# EAGLE board schematic_March8 (EAGLE 9.3.0), part 1 of 2
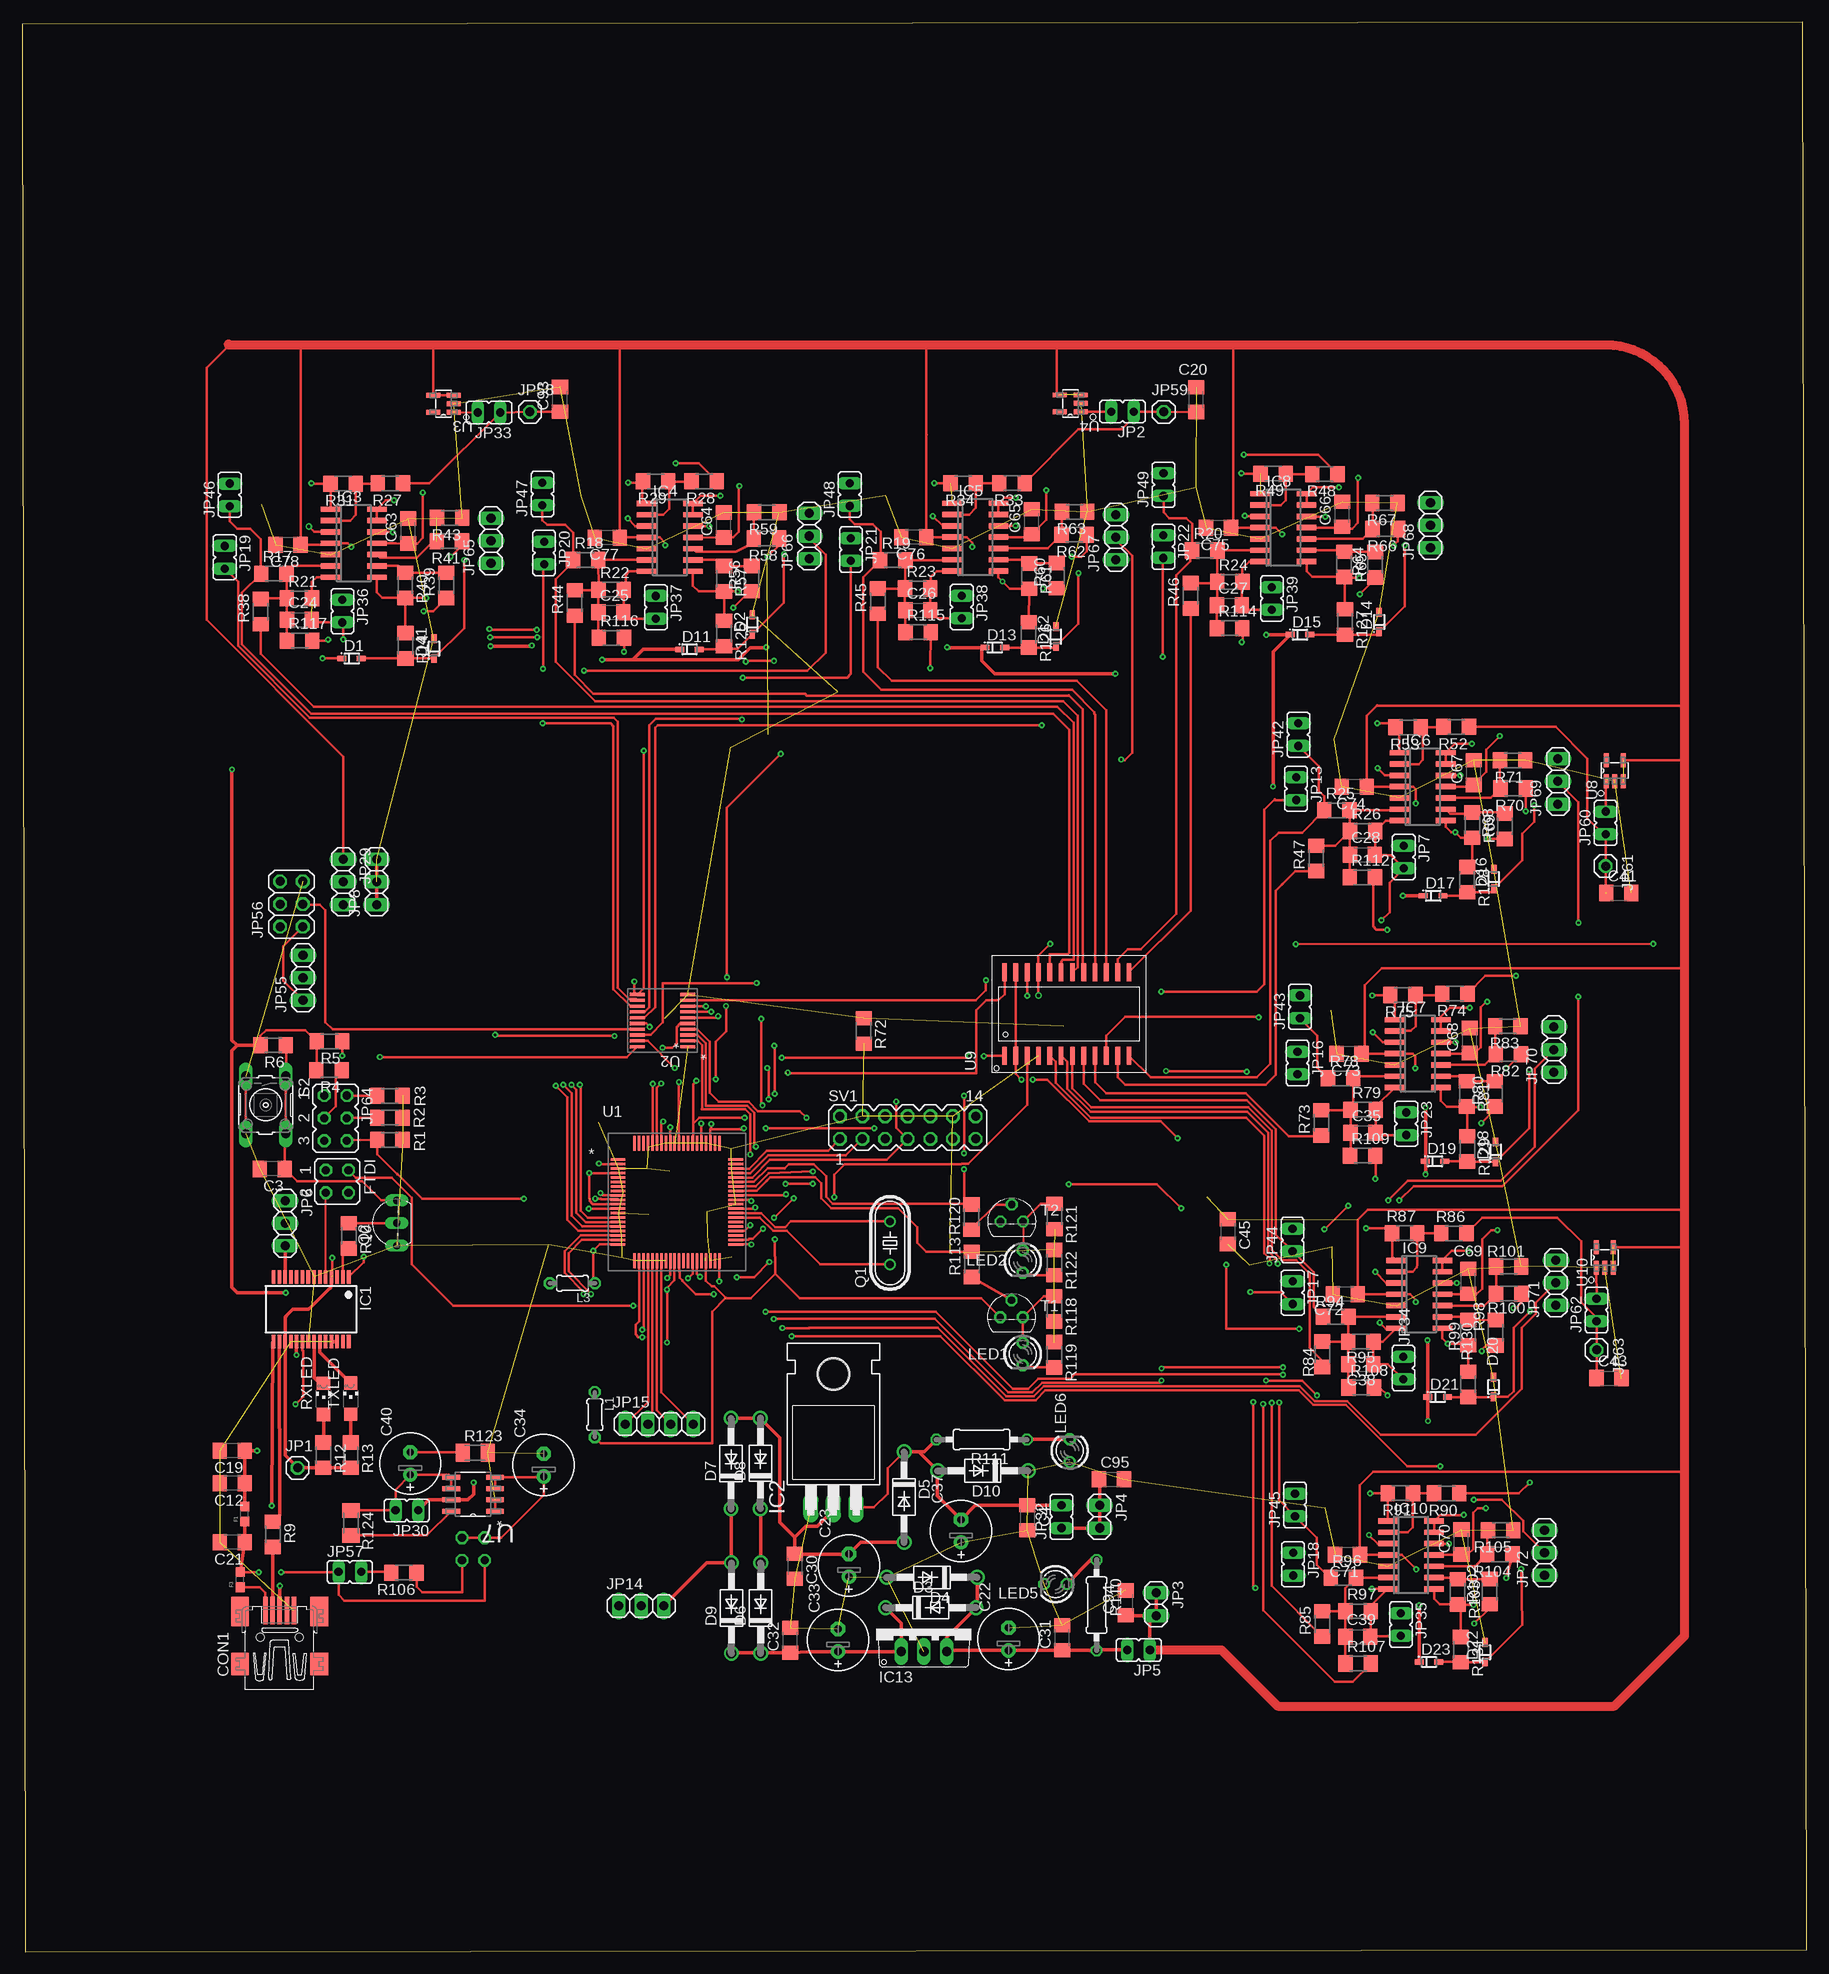
[diagram p2: board, top side]
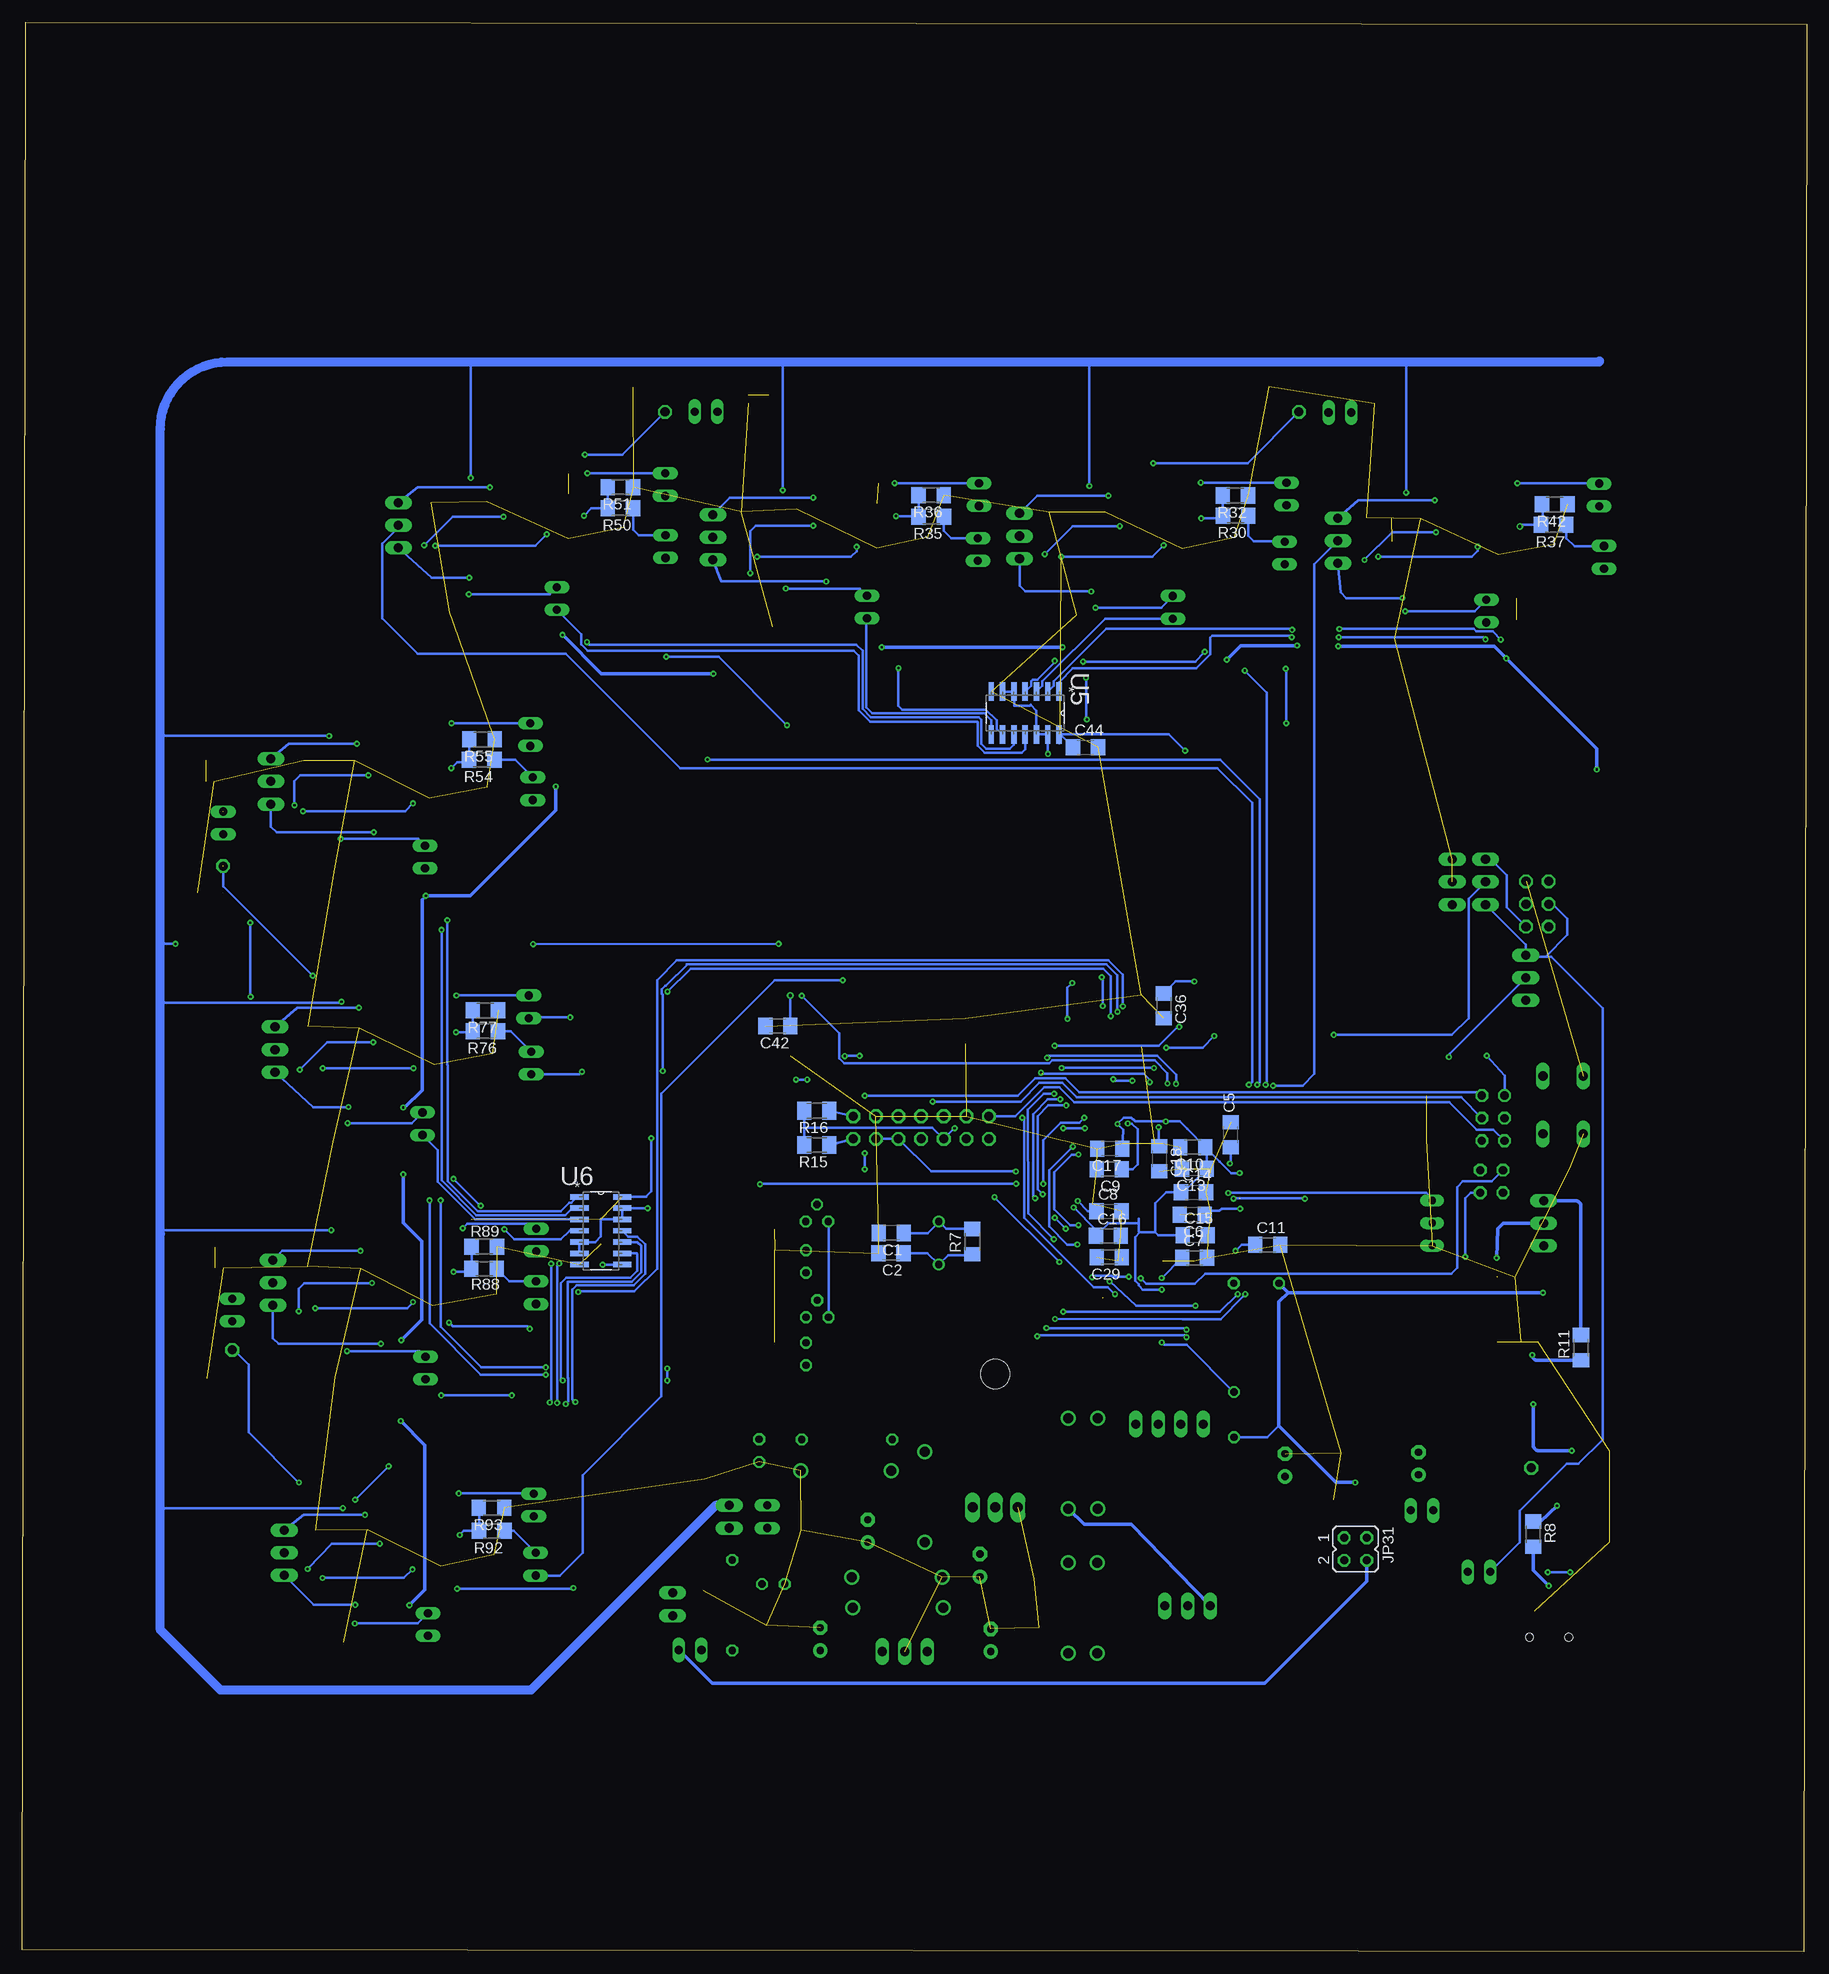
[diagram p3: board, bottom side, seen from below]

Size 200.34 x 216.64 mm. Coordinates in mm from the lower left corner, seen from the top.
Outline: 0.33,0 200.34,0.23 199.93,216.64 0,216.41 0.33,0
Copper layers (1*16): Top 0.035mm / dielectric 1.5mm / Bottom 0.035mm
Design rules "default *": minimum track width 8mil, minimum drill 10mil, track to track 7mil, track to pad 7mil, pad to pad 7mil, via to via 7mil, smd to smd 7mil, copper to edge 10mil, drill to drill 7mil, minimum pad ring 10mil, minimum via ring 8mil, stop-mask expansion 4mil, vias tented up to drill 0mil, thermal gap 10mil
Net classes: 1 power: width 0.254 mm

## Footprints (pad centres in the part's own frame; a part is rotated, then mirrored left to right if it is on the bottom)
C1206 = smd 1.6 x 1.8: 1 -1.4,0; 2 1.4,0
E2,5-7 = drill 0.813 pad 1.6: + -1.27,0 | drill 0.813 pad 1.6 octagon: - 1.27,0
32005-201 = smd 3.1 x 0.5: 1 3,1.6; 2 3,0.8; 3 3,0; 4 3,-0.8; 5 3,-1.6 | smd 2.5 x 2: M1 -3,-4.45; M2 -3,4.45 | smd 3.3 x 2: M3 2.9,4.45; M4 2.9,-4.45 | hole 0.9: 0,2.2; 0,-2.2
SOD323F = smd 1 x 0.6: A 1.1,0; C -1.1,0
DO41-10 = drill 1.118: A 5.08,0; C -5.08,0
0603 = smd 1.1 x 1: 1 -0.85,0; 2 0.85,0
JP2Q = drill 0.914 octagon: 1 -1.27,-1.27; 2 1.27,-1.27; 3 -1.27,1.27; 4 1.27,1.27
SSOP28 = smd 0.4 x 1.5: 1 -4.225,-3.625; 2 -3.575,-3.625; 3 -2.925,-3.625; 4 -2.275,-3.625; 5 -1.625,-3.625; 6 -0.975,-3.625; 7 -0.325,-3.625; 8 0.325,-3.625; 9 0.975,-3.625; 10 1.625,-3.625; 11 2.275,-3.625; 12 2.925,-3.625; 13 3.575,-3.625; 14 4.225,-3.625; 15 4.225,3.625; 16 3.575,3.625; 17 2.925,3.625; 18 2.275,3.625; 19 1.625,3.625; 20 0.975,3.625; 21 0.325,3.625; 22 -0.325,3.625; 23 -0.975,3.625; 24 -1.625,3.625; 25 -2.275,3.625; 26 -2.925,3.625; 27 -3.575,3.625; 28 -4.225,3.625
TO220H = drill 1.118 long: 1 -2.54,-10.16; 2 0,-10.16; 3 2.54,-10.16 | hole 3.302: 0,4.826
SO14 = smd 0.6 x 2.2: 1 -3.81,-2.6; 2 -2.54,-2.6; 3 -1.27,-2.6; 4 0,-2.6; 5 1.27,-2.6; 6 2.54,-2.6; 7 3.81,-2.6; 8 3.81,2.6; 9 2.54,2.6; 10 1.27,2.6; 11 0,2.6; 12 -1.27,2.6; 13 -2.54,2.6; 14 -3.81,2.6
TO220V = drill 1.016 long: 1 -2.54,-2.54; 2 0,-2.54; 3 2.54,-2.54
1X01 = drill 1.016 octagon: 1 0,0
JP1 = drill 0.914 long: 1 0,-1.27; 2 0,1.27
1X02 = drill 1.016 long: 1 -1.27,0; 2 1.27,0
1X03 = drill 1.016 long: 1 -2.54,0; 2 0,0; 3 2.54,0
1X04 = drill 1.016 long: 1 -3.81,0; 2 -1.27,0; 3 1.27,0; 4 3.81,0
2X03 = drill 1.016 octagon: 1 -2.54,-1.27; 2 -2.54,1.27; 3 0,-1.27; 4 0,1.27; 5 2.54,-1.27; 6 2.54,1.27
JP3Q = drill 0.914 octagon: 1 -2.54,-1.27; 2 -2.54,1.27; 3 0,-1.27; 4 0,1.27; 5 2.54,-1.27; 6 2.54,1.27
0204/5 = drill 0.813 octagon: 1 -2.54,0; 2 2.54,0
LED3MM = drill 0.813 octagon: A -1.27,0; K 1.27,0
HC49/S = drill 0.813: 1 -2.413,0; 2 2.413,0
TO92-EBC = drill 0.813 long: B 0,-1.27; C -2.54,-1.27; E 2.54,-1.27
R1206 = smd 1.6 x 1.803: 1 -1.422,0; 2 1.422,0
M1206 = smd 1.6 x 2: 1 -1.4,0; 2 1.4,0
0207/10 = drill 0.813 octagon: 1 -5.08,0; 2 5.08,0
CHIPLED_1206 = smd 1.5 x 1.5: A 0,-1.75; C 0,1.75
B3F-10XX = drill 1.016 long: 1 -3.251,2.261; 2 3.251,2.261; 3 -3.251,-2.261; 4 3.251,-2.261
MA07-2 = drill 1.016 octagon: 1 -7.62,-1.27; 2 -7.62,1.27; 3 -5.08,-1.27; 4 -5.08,1.27; 5 -2.54,-1.27; 6 -2.54,1.27; 7 0,-1.27; 8 0,1.27; 9 2.54,-1.27; 10 2.54,1.27; 11 5.08,-1.27; 12 5.08,1.27; 13 7.62,-1.27; 14 7.62,1.27
TO92 = drill 0.813 octagon: 1 1.27,0; 2 0,1.905; 3 -1.27,0
PN80 = smd 1.676 x 0.279: 1 -6.617,4.75; 2 -6.617,4.25; 3 -6.617,3.75; 4 -6.617,3.25; 5 -6.617,2.75; 6 -6.617,2.25; 7 -6.617,1.75; 8 -6.617,1.25; 9 -6.617,0.75; 10 -6.617,0.25; 11 -6.617,-0.25; 12 -6.617,-0.75; 13 -6.617,-1.25; 14 -6.617,-1.75; 15 -6.617,-2.25; 16 -6.617,-2.75; 17 -6.617,-3.25; 18 -6.617,-3.75; 19 -6.617,-4.25; 20 -6.617,-4.75; 41 6.617,-4.75; 42 6.617,-4.25; 43 6.617,-3.75; 44 6.617,-3.25; 45 6.617,-2.75; 46 6.617,-2.25; 47 6.617,-1.75; 48 6.617,-1.25; 49 6.617,-0.75; 50 6.617,-0.25; 51 6.617,0.25; 52 6.617,0.75; 53 6.617,1.25; 54 6.617,1.75; 55 6.617,2.25; 56 6.617,2.75; 57 6.617,3.25; 58 6.617,3.75; 59 6.617,4.25; 60 6.617,4.75 | smd 0.279 x 1.676: 21 -4.75,-6.617; 22 -4.25,-6.617; 23 -3.75,-6.617; 24 -3.25,-6.617; 25 -2.75,-6.617; 26 -2.25,-6.617; 27 -1.75,-6.617; 28 -1.25,-6.617; 29 -0.75,-6.617; 30 -0.25,-6.617; 31 0.25,-6.617; 32 0.75,-6.617; 33 1.25,-6.617; 34 1.75,-6.617; 35 2.25,-6.617; 36 2.75,-6.617; 37 3.25,-6.617; 38 3.75,-6.617; 39 4.25,-6.617; 40 4.75,-6.617; 61 4.75,6.617; 62 4.25,6.617; 63 3.75,6.617; 64 3.25,6.617; 65 2.75,6.617; 66 2.25,6.617; 67 1.75,6.617; 68 1.25,6.617; 69 0.75,6.617; 70 0.25,6.617; 71 -0.25,6.617; 72 -0.75,6.617; 73 -1.25,6.617; 74 -1.75,6.617; 75 -2.25,6.617; 76 -2.75,6.617; 77 -3.25,6.617; 78 -3.75,6.617; 79 -4.25,6.617; 80 -4.75,6.617
PW20 = smd 1.676 x 0.356: 1 -2.819,2.925; 2 -2.819,2.275; 3 -2.819,1.625; 4 -2.819,0.975; 5 -2.819,0.325; 6 -2.819,-0.325; 7 -2.819,-0.975; 8 -2.819,-1.625; 9 -2.819,-2.275; 10 -2.819,-2.925; 11 2.819,-2.925; 12 2.819,-2.275; 13 2.819,-1.625; 14 2.819,-0.975; 15 2.819,-0.325; 16 2.819,0.325; 17 2.819,0.975; 18 2.819,1.625; 19 2.819,2.275; 20 2.819,2.925
DDC0005A_N = smd 1.575 x 0.559: 1 -1.168,0.95; 2 -1.168,0; 3 -1.168,-0.95; 4 1.168,-0.95; 5 1.168,0.95
SOIC127P600X175-14N = smd 2.057 x 0.61: 1 -4.801,7.62; 2 -4.801,6.35; 3 -4.801,5.08; 4 -4.801,3.81; 5 -4.801,2.54; 6 -4.801,1.27; 7 -4.801,0; 8 0,0; 9 0,1.27; 10 0,2.54; 11 0,3.81; 12 0,5.08; 13 0,6.35; 14 0,7.62
SOIC127P600X175-8N = smd 1.981 x 0.559: 1 -2.464,1.905; 2 -2.464,0.635; 3 -2.464,-0.635; 4 -2.464,-1.905; 5 2.464,-1.905; 6 2.464,-0.635; 7 2.464,0.635; 8 2.464,1.905
21-0042B_24 = smd 1.981 x 0.533: 1 -4.686,6.985; 2 -4.686,5.715; 3 -4.686,4.445; 4 -4.686,3.175; 5 -4.686,1.905; 6 -4.686,0.635; 7 -4.686,-0.635; 8 -4.686,-1.905; 9 -4.686,-3.175; 10 -4.686,-4.445; 11 -4.686,-5.715; 12 -4.686,-6.985; 13 4.686,-6.985; 14 4.686,-5.715; 15 4.686,-4.445; 16 4.686,-3.175; 17 4.686,-1.905; 18 4.686,-0.635; 19 4.686,0.635; 20 4.686,1.905; 21 4.686,3.175; 22 4.686,4.445; 23 4.686,5.715; 24 4.686,6.985

## Placement (x,y rotation side)
C1  36p  [C1206]  102.77,80.7 180 bottom
C2  36p  [C1206]  102.79,78.44 180 bottom
C3  0.1u  [C1206]  28.07,87.88 180 top
C4  0.1uF  [C1206]  112.85,48.72 270 top
C5  2.2u  [C1206]  64.67,91.72 90 bottom
C6  2.2u  [C1206]  68.96,82.75 180 bottom
C7  2.2u  [C1206]  68.71,77.93 0 bottom
C8  2.2u  [C1206]  78.31,83.13 0 bottom
C9  2.2u  [C1206]  78.28,87.86 180 bottom
C10  2.2u  [C1206]  68.91,90.32 180 bottom
C11  2.2u  [C1206]  60.5,79.38 0 bottom
C12  100nF  [C1206]  23.57,52.58 180 top
C13  2.2u  [C1206]  68.73,87.93 180 bottom
C14  2.2u  [C1206]  68.83,85.29 0 bottom
C15  2.2u  [C1206]  68.63,80.44 0 bottom
C16  2.2u  [C1206]  78.38,80.37 0 bottom
C17  2.2u  [C1206]  78.23,90.17 180 bottom
C18  2.2u  [C1206]  72.67,89.03 270 bottom
C19  4.7uF  [C1206]  23.57,56.26 180 top
C20  2.2u  [C1206]  131.8,174.27 90 top
C21  10nF  [C1206]  23.57,45.97 180 top
C22  10uF  [E2,5-7]  110.74,35.1 90 top
C23  1000uF  [E2,5-7]  92.81,43.38 90 top
C24  [C1206]  31.12,149.56 0 top
C25  [C1206]  66.09,150.37 0 top
C26  [C1206]  100.56,150.6 0 top
C27  [C1206]  135.53,151.18 0 top
C28  [C1206]  150.47,123.19 0 top
C29  0.1u  [C1206]  78.28,77.98 180 bottom
C30  0.1uF  [C1206]  86.74,43.28 270 top
C31  0.1uF  [C1206]  116.76,35.26 90 top
C32  0.1uF  [C1206]  86.23,34.98 90 top
C33  1000uF  [E2,5-7]  91.59,34.98 90 top
C34  0.1uF  [E2,5-7]  58.55,54.64 90 top
C35  [C1206]  150.55,91.95 0 top
C36  2.2u  [C1206]  72.16,106.2 270 bottom
C37  10uF  [E2,5-7]  105.41,47.24 90 top
C38  [C1206]  150.29,65.96 0 top
C39  [C1206]  149.96,35.38 0 top
C40  10uF  [E2,5-7]  43.56,54.81 90 top
C41  2.2u  [C1206]  179.25,118.87 0 top
C42  2.2u  [C1206]  115.49,103.94 180 bottom
C43  2.2u  [C1206]  178.16,64.41 0 top
C44  2.2u  [C1206]  80.95,135.25 0 bottom
C45  2.2u  [C1206]  135.36,80.85 270 top
C63  2.2u  [C1206]  43.33,159.51 90 top
C64  2.2u  [C1206]  78.77,160.2 90 top
C65  2.2u  [C1206]  113.36,160.55 90 top
C66  2.2u  [C1206]  148.21,161.39 90 top
C67  2.2u  [C1206]  162.99,132.38 90 top
C68  2.2u  [C1206]  162.51,102.31 90 top
C69  2.2u  [C1206]  162.33,75.29 90 top
C70  2.2u  [C1206]  161.59,46 90 top
C71  2.2u  [C1206]  148.79,44.58 180 top
C72  2.2u  [C1206]  148.54,73.81 180 top
C73  2.2u  [C1206]  148.97,100.84 180 top
C74  2.2u  [C1206]  149.56,130.78 180 top
C75  2.2u  [C1206]  134.32,159.87 180 top
C76  2.2u  [C1206]  100.1,158.83 180 top
C77  2.2u  [C1206]  65.68,158.78 180 top
C78  2.2u  [C1206]  29.84,157.99 180 top
C93  2.2u  [C1206]  60.38,174.29 90 top
C94  2.2u  [C1206]  123.88,39.17 90 top
C95  2.2u  [C1206]  122.3,53.04 0 top
CON1  UBC05V128-B0C04D  [32005-201]  28.91,35.31 90 top
D1  1N914BWS  [SOD323F]  36.98,145.21 0 top
D2  1N914BWS  [SOD323F]  81.97,149.02 90 top
D3  1N4004  [DO41-10]  102.01,38.63 0 top
D4  1N4004  [DO41-10]  102.13,42.04 180 top
D5  1N4004  [DO41-10]  99.01,51.05 270 top
D6  1N4004  [DO41-10]  82.91,38.58 90 top
D7  1N4004  [DO41-10]  79.58,54.81 90 top
D8  1N4004  [DO41-10]  82.88,54.84 90 top
D9  1N4004  [DO41-10]  79.63,38.58 90 top
D10  1N4004  [DO41-10]  107.85,54 180 top
D11  1N914BWS  [SOD323F]  74.93,146.23 0 top
D12  1N914BWS  [SOD323F]  116.05,147.65 90 top
D13  1N914BWS  [SOD323F]  109.19,146.43 0 top
D14  1N914BWS  [SOD323F]  152.35,149.3 90 top
D15  1N914BWS  [SOD323F]  143.46,147.88 0 top
D16  1N914BWS  [SOD323F]  165.23,120.45 90 top
D17  1N914BWS  [SOD323F]  158.42,118.57 0 top
D18  1N914BWS  [SOD323F]  165.43,89.81 90 top
D19  1N914BWS  [SOD323F]  158.62,88.75 0 top
D20  1N914BWS  [SOD323F]  165.18,63.4 90 top
D21  1N914BWS  [SOD323F]  158.93,62.28 0 top
D22  1N914BWS  [SOD323F]  164.24,33.63 90 top
D23  1N914BWS  [SOD323F]  157.94,32.54 0 top
D41  1N914BWS  [SOD323F]  46.23,146.3 90 top
F1  500mA  [0603]  24.97,49.15 90 top
F3  500mA  [0603]  24.46,41.78 90 top
FTDI  [JP2Q]  35.36,86.49 270 top
IC1  FT232RL  [SSOP28]  32.44,72.14 180 top
IC2  [TO220H]  91.08,60.05 0 top
IC3  TL084D  [SO14]  37.21,158.14 270 top
IC4  TL084D  [SO14]  72.69,158.8 270 top
IC5  TL084D  [SO14]  107.01,158.83 270 top
IC6  TL084D  [SO14]  157.23,130.81 270 top
IC7  TL084D  [SO14]  156.69,100.84 270 top
IC8  TL084D  [SO14]  141.6,159.89 270 top
IC9  TL084D  [SO14]  156.84,73.81 270 top
IC10  TL084D  [SO14]  155.93,44.55 270 top
IC13  7805TV  [TO220V]  101.24,36.25 0 top
JP1  [1X01]  30.91,54.33 0 top
JP2  [JP1]  123.55,172.92 90 top
JP3  [1X02]  127.3,39.01 270 top
JP4  [1X02]  120.95,48.84 270 top
JP5  [JP1]  125.35,33.88 90 top
JP6  [1X03]  29.51,81.79 270 top
JP7  [JP1]  155.12,122.91 180 top
JP8  [1X03]  39.78,120.12 90 top
JP13  [JP1]  143.03,130.58 180 top
JP14  [1X03]  69.49,38.84 0 top
JP15  [1X04]  71.53,59.23 0 top
JP16  [JP1]  143.18,99.77 180 top
JP17  [JP1]  142.65,73.99 180 top
JP18  [JP1]  142.7,43.51 180 top
JP19  [JP1]  22.73,156.57 180 top
JP20  [JP1]  58.6,157.05 180 top
JP21  [JP1]  93.04,157.43 180 top
JP22  [JP1]  128.12,157.76 180 top
JP23  [JP1]  155.4,92.96 180 top
JP29  [1X03]  36.04,120.12 270 top
JP30  [JP1]  43.18,49.56 90 top
JP31  [JP2Q]  50.65,45.21 270 bottom
JP32  [JP1]  116.69,48.84 0 top
JP33  [JP1]  52.4,172.82 90 top
JP34  pls  [JP1]  155.07,65.53 180 top
JP35  [JP1]  154.79,36.73 180 top
JP36  [JP1]  35.94,150.52 180 top
JP37  [JP1]  71.15,150.95 180 top
JP38  [JP1]  105.49,150.98 180 top
JP39  [JP1]  140.31,151.94 180 top
JP42  [JP1]  143.28,136.65 0 top
JP43  [JP1]  143.46,106.1 0 top
JP44  Int_inp  [JP1]  142.62,79.91 0 top
JP45  [JP1]  142.9,50.17 0 top
JP46  [JP1]  23.29,163.58 0 top
JP47  [JP1]  58.39,163.68 0 top
JP48  [JP1]  92.91,163.6 0 top
JP49  [JP1]  128.14,164.72 0 top
JP55  [1X03]  31.52,109.35 90 top
JP56  [2X03]  30.23,117.63 90 top
JP57  [JP1]  36.78,42.65 270 top
JP58  [1X01]  57,172.9 0 top
JP59  [1X01]  128.17,172.9 0 top
JP60  [JP1]  177.77,126.75 0 top
JP61  [1X01]  177.77,121.89 270 top
JP62  [JP1]  176.76,72.06 0 top
JP63  [1X01]  176.76,67.56 270 top
JP64  [JP3Q]  35.18,93.6 270 top
JP65  [1X03]  52.63,158.42 90 top
JP66  [1X03]  88.37,158.95 90 top
JP67  [1X03]  122.78,158.83 90 top
JP68  [1X03]  158.11,160.17 90 top
JP69  [1X03]  172.42,131.39 90 top
JP70  [1X03]  171.96,101.3 90 top
JP71  [1X03]  172.19,75.11 90 top
JP72  [1X03]  170.92,44.81 90 top
L1  BKP1005HS221-T  [0204/5]  64.29,60.3 270 top
L3  BKP1005HS221-T  [0204/5]  61.77,75.06 180 top
LED1  [LED3MM]  112.34,67.11 270 top
LED2  [LED3MM]  112.34,77.5 270 top
LED5  [LED3MM]  116,41.28 180 top
LED6  [LED3MM]  117.6,56.26 90 top
Q1  [HC49/S]  97.43,79.58 90 top
Q2  BC557  [TO92-EBC]  40.77,81.81 90 top
R1  2.2k  [R1206]  41.27,91.16 180 top
R2  2.2k  [R1206]  41.27,93.65 180 top
R3  2.2k  [R1206]  41.27,96.09 180 top
R4  820  [R1206]  34.44,98.98 180 top
R5  820  [R1206]  34.49,102.21 180 top
R6  2.2k  [R1206]  28.17,101.78 180 top
R7  1M  [R1206]  93.65,79.73 90 bottom
R8  33  [R1206]  30.68,46.89 270 bottom
R9  33  [R1206]  28.14,46.86 270 top
R10  2.2k  [R1206]  36.68,80.37 270 top
R11  10k  [R1206]  25.32,67.82 90 bottom
R12  270  [R1206]  33.81,55.75 270 top
R13  270  [R1206]  36.88,55.75 270 top
R14  [R1206]  43.03,146.63 270 top
R15  4.7k  [M1206]  111.12,90.58 180 bottom
R16  4.7k  [M1206]  111.12,94.44 180 bottom
R17  [R1206]  28.24,154.74 0 top
R18  [R1206]  63.25,156.26 0 top
R19  [R1206]  97.74,156.24 0 top
R20  [R1206]  132.77,157.33 0 top
R21  [R1206]  31.12,151.94 0 top
R22  [R1206]  66.12,152.93 0 top
R23  [R1206]  100.53,153.06 0 top
R24  [R1206]  135.59,153.8 0 top
R25  [R1206]  147.6,128.14 0 top
R26  [R1206]  150.5,125.83 0 top
R27  [R1206]  41.33,164.87 180 top
R28  [R1206]  76.56,165.1 180 top
R29  [R1206]  71.12,165.1 180 top
R30  [R1206]  64.11,161.24 180 bottom
R31  [R1206]  36.02,164.85 180 top
R32  [R1206]  64.13,163.5 180 bottom
R33  [R1206]  111.12,164.9 180 top
R34  [R1206]  105.64,164.87 180 top
R35  [R1206]  98.27,161.14 180 bottom
R36  [R1206]  98.3,163.55 180 bottom
R37  [R1206]  28.4,160.2 180 bottom
R38  [R1206]  26.77,150.47 90 top
R39  [R1206]  47.62,153.42 90 top
R40  [R1206]  43,153.42 270 top
R41  [R1206]  47.96,158.37 180 top
R42  [R1206]  28.27,162.51 180 bottom
R43  [R1206]  47.98,160.99 180 top
R44  [R1206]  62.03,151.43 90 top
R45  [R1206]  96.06,151.64 90 top
R46  [R1206]  131.19,152.25 90 top
R47  [R1206]  145.29,122.76 90 top
R48  [R1206]  146.25,165.91 180 top
R49  [R1206]  140.44,165.96 180 top
R50  [R1206]  133.17,162.08 180 bottom
R51  [R1206]  133.17,164.44 180 bottom
R52  [R1206]  161.01,137.52 180 top
R53  [R1206]  155.6,137.46 180 top
R54  [R1206]  148.74,133.83 180 bottom
R55  [R1206]  148.72,136.12 180 bottom
R56  [R1206]  81.89,154.18 90 top
R57  [R1206]  78.79,154.15 270 top
R58  [R1206]  83.57,158.67 180 top
R59  [R1206]  83.59,161.62 180 top
R60  [R1206]  116.15,154.51 90 top
R61  [R1206]  113.06,154.46 270 top
R62  [R1206]  118.11,159.11 180 top
R63  [R1206]  118.16,161.67 180 top
R64  [R1206]  151.89,155.73 90 top
R65  [R1206]  148.41,155.78 270 top
R66  [R1206]  153.03,159.74 180 top
R67  [R1206]  152.98,162.66 180 top
R68  [R1206]  166.47,126.37 90 top
R69  [R1206]  162.81,126.49 270 top
R70  [R1206]  167.39,130.61 180 top
R71  [R1206]  167.34,133.76 180 top
R72  0  [R1206]  94.46,103.38 270 top
R73  [R1206]  145.87,93.07 90 top
R74  [R1206]  160.86,107.57 180 top
R75  [R1206]  155.02,107.42 180 top
R76  [R1206]  148.34,103.35 180 bottom
R77  [R1206]  148.34,105.69 180 bottom
R78  [R1206]  148.03,98.07 0 top
R79  [R1206]  150.55,94.54 0 top
R80  [R1206]  165.35,96.32 90 top
R81  [R1206]  162.2,96.32 270 top
R82  [R1206]  166.85,100.79 180 top
R83  [R1206]  166.8,103.91 180 top
R84  [R1206]  145.97,67.08 90 top
R85  [R1206]  145.97,36.8 90 top
R86  [R1206]  160.73,80.65 180 top
R87  [R1206]  155.22,80.67 180 top
R88  [R1206]  148.49,76.68 180 bottom
R89  [R1206]  148.46,79.17 180 bottom
R90  [R1206]  159.92,51.46 180 top
R91  [R1206]  154.74,51.49 180 top
R92  [R1206]  147.62,47.24 180 bottom
R93  [R1206]  147.65,49.83 180 bottom
R94  [R1206]  147.47,71.27 0 top
R95  [R1206]  150.29,68.5 0 top
R96  [R1206]  148.34,41.99 0 top
R97  [R1206]  149.99,38.23 0 top
R98  [R1206]  165.43,69.49 90 top
R99  [R1206]  162.33,69.52 270 top
R100  [R1206]  166.9,73.89 180 top
R101  [R1206]  166.88,76.94 180 top
R102  [R1206]  164.74,40.44 90 top
R103  [R1206]  161.16,40.41 270 top
R104  [R1206]  165.91,44.6 180 top
R105  [R1206]  165.99,47.35 180 top
R106  0  [R1206]  42.85,42.57 180 top
R107  [R1206]  149.99,32.36 0 top
R108  [R1206]  150.34,63.35 0 top
R109  [R1206]  150.5,89.38 0 top
R110  1K  [0207/10]  120.62,38.91 270 top
R111  1K  [0207/10]  107.72,57.51 180 top
R112  [R1206]  150.47,120.62 0 top
R113  470  [R1206]  106.63,77.17 90 top
R114  [R1206]  135.56,148.62 0 top
R115  [R1206]  100.58,148.16 0 top
R116  [R1206]  66.14,147.52 0 top
R117  [R1206]  31.14,147.22 0 top
R118  10k  [R1206]  115.87,72.19 270 top
R119  470  [R1206]  115.87,67.03 270 top
R120  470  [R1206]  106.58,82.47 90 top
R121  10k  [R1206]  115.9,82.55 270 top
R122  470  [R1206]  115.87,77.37 270 top
R123  1  [M1206]  50.85,56.01 0 top
R124  1  [M1206]  36.91,48.13 270 top
R125  [R1206]  78.79,148.01 270 top
R126  [R1206]  113,147.85 270 top
R127  [R1206]  148.51,149.3 270 top
R128  [R1206]  162.23,120.37 270 top
R129  [R1206]  162.26,90.14 270 top
R130  [R1206]  162.33,63.7 270 top
R131  [R1206]  161.52,33.91 270 top
RXLED  [CHIPLED_1206]  33.83,62.08 0 top
S2  [B3F-10XX]  27.33,95.07 270 top
SV1  JTAG  [MA07-2]  99.42,92.53 0 top
T1  BC547  [TO92]  111.07,71.25 0 top
T2  BC547  [TO92]  111.1,81.99 0 top
TXLED  [CHIPLED_1206]  36.88,62.1 0 top
U1  TMS320F28069_PN_80  [PN80]  73.51,84.18 0 top
U2  TLV5610_PW_20  [PW20]  71.88,104.55 180 top
U3  REF2030AIDDCR  [DDC0005A_N]  47.29,173.81 180 top
U4  REF2030AIDDCR  [DDC0005A_N]  117.68,173.84 180 top
U5  TS12A44514DR  [SOIC127P600X175-14N]  91.54,136.68 270 bottom
U6  TS12A44514DR  [SOIC127P600X175-14N]  132.97,77.14 0 bottom
U7  TPS7333QD  [SOIC127P600X175-8N]  50.62,51.36 180 top
U8  REF2030AIDDCR  [DDC0005A_N]  178.79,132.61 90 top
U9  MAX395CWG+  [21-0042B_24]  117.27,105.28 90 top
U10  REF2030AIDDCR  [DDC0005A_N]  177.7,77.95 90 top